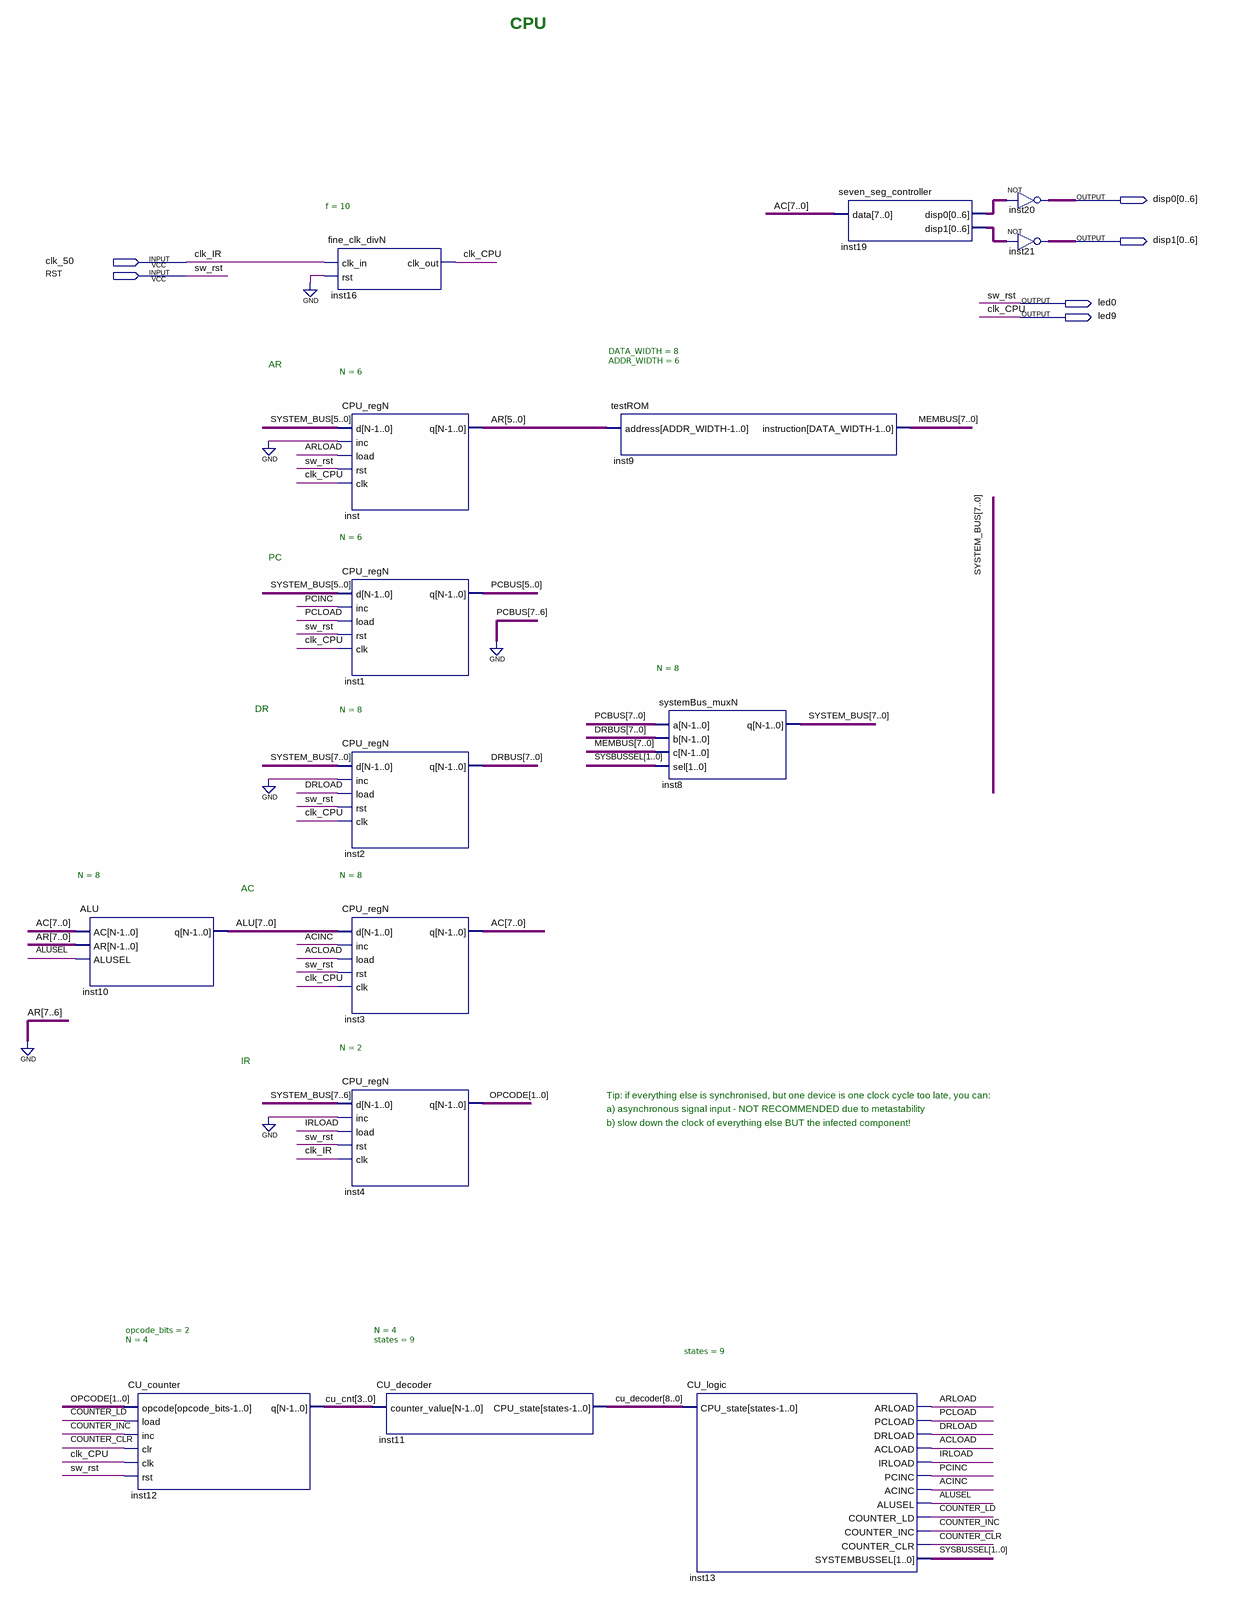
[diagram p0: schematic sheet]
// Quartus schematic SimpleCPU.bdf as structural Verilog: 15 symbols, 6 pins
module SimpleCPU (
  input  clk_50,
  input  RST,
  output [0:6] disp0,
  output [0:6] disp1,
  output led0,
  output led9
);

  wire ACINC, ACLOAD, ALUSEL, ARLOAD, COUNTER_CLR, COUNTER_INC, COUNTER_LD, DRLOAD, IRLOAD, PCINC, PCLOAD;
  wire [1:0] OPCODE, SYSBUSSEL;
  wire [3:0] cu_cnt;
  wire [5:0] AR, PCBUS;
  wire [6:0] inst19_disp0, inst19_disp1;
  wire [7:0] AC, ALU, DRBUS, MEMBUS, SYSTEM_BUS;
  wire [8:0] cu_decoder;

  ALU #(.N(8)) inst10 (.AC(AC), .AR({2'b00, AR}), .ALUSEL(ALUSEL), .q(ALU));
  CU_counter #(.opcode_bits(2), .N(4)) inst12 (
    .opcode(OPCODE), .load(COUNTER_LD), .inc(COUNTER_INC), .clr(COUNTER_CLR), .clk(led9), .rst(RST),
    .q(cu_cnt));
  fine_clk_divN #(.f(10)) inst16 (.clk_in(clk_50), .rst(1'b0), .clk_out(led9));
  CPU_regN #(.N(6)) inst (.d(SYSTEM_BUS[5:0]), .inc(1'b0), .load(ARLOAD), .rst(RST), .clk(led9), .q(AR));
  CPU_regN #(.N(6)) inst1 (.d(SYSTEM_BUS[5:0]), .inc(PCINC), .load(PCLOAD), .rst(RST), .clk(led9), .q(PCBUS));
  CPU_regN #(.N(8)) inst2 (.d(SYSTEM_BUS), .inc(1'b0), .load(DRLOAD), .rst(RST), .clk(led9), .q(DRBUS));
  CPU_regN #(.N(8)) inst3 (.d(ALU), .inc(ACINC), .load(ACLOAD), .rst(RST), .clk(led9), .q(AC));
  CPU_regN #(.N(2)) inst4 (.d(SYSTEM_BUS[7:6]), .inc(1'b0), .load(IRLOAD), .rst(RST), .clk(clk_50), .q(OPCODE));
  CU_decoder #(.N(4), .states(9)) inst11 (.counter_value(cu_cnt), .CPU_state(cu_decoder));
  testROM #(.DATA_WIDTH(8), .ADDR_WIDTH(6)) inst9 (.address(AR), .instruction(MEMBUS));
  systemBus_muxN #(.N(8)) inst8 (.a({2'b00, PCBUS}), .b(DRBUS), .c(MEMBUS), .sel(SYSBUSSEL), .q(SYSTEM_BUS));
  CU_logic #(.states(9)) inst13 (
    .CPU_state(cu_decoder), .ARLOAD(ARLOAD), .PCLOAD(PCLOAD), .DRLOAD(DRLOAD), .ACLOAD(ACLOAD),
    .IRLOAD(IRLOAD), .PCINC(PCINC), .ACINC(ACINC), .ALUSEL(ALUSEL), .COUNTER_LD(COUNTER_LD),
    .COUNTER_INC(COUNTER_INC), .COUNTER_CLR(COUNTER_CLR), .SYSTEMBUSSEL(SYSBUSSEL));
  seven_seg_controller inst19 (.data(AC), .disp0(inst19_disp0), .disp1(inst19_disp1));
  assign disp0 = ~inst19_disp0;  // NOT inst20, 7 bits wide
  assign disp1 = ~inst19_disp1;  // NOT inst21, 7 bits wide

  assign led0 = RST;

  // Other names for the same wires on the sheet: clk_CPU = led9; clk_IR = clk_50; sw_rst = RST

  // Notes on the sheet:
  //   CPU
  //   AR
  //   PC
  //   DR
  //   AC
  //   IR
  //   Tip: if everything else is synchronised, but one device is one clock cycle too late, you can:
  //   a) asynchronous signal input - NOT RECOMMENDED due to metastability
  //   b) slow down the clock of everything else BUT the infected component!
endmodule
